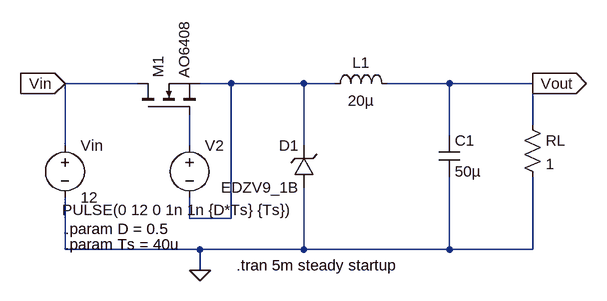
[diagram p0: schematic Draft2.asc]
Draft2.asc, the LTspice schematic file:
Version 4
SHEET 1 916 680
WIRE 16 32 -96 32
WIRE 160 32 112 32
WIRE 272 32 160 32
WIRE 320 32 272 32
WIRE 496 32 400 32
WIRE 624 32 496 32
WIRE 624 96 624 32
WIRE 496 112 496 32
WIRE -96 128 -96 32
WIRE 96 128 96 80
WIRE 272 128 272 32
WIRE 96 240 96 208
WIRE 160 240 160 32
WIRE 160 240 96 240
WIRE -96 288 -96 208
WIRE 112 288 -96 288
WIRE 272 288 272 192
WIRE 272 288 112 288
WIRE 496 288 496 176
WIRE 496 288 272 288
WIRE 624 288 624 176
WIRE 624 288 496 288
WIRE 112 320 112 288
FLAG -96 32 Vin
IOPIN -96 32 In
FLAG 624 32 Vout
IOPIN 624 32 Out
FLAG 112 320 0
SYMBOL nmos 16 80 R270
SYMATTR InstName M1
SYMATTR Value AO6408
SYMBOL ind 304 48 R270
WINDOW 0 32 56 VTop 2
WINDOW 3 5 56 VBottom 2
SYMATTR InstName L1
SYMATTR Value 20µ
SYMATTR SpiceLine Rser=20m
SYMBOL zener 288 192 R180
WINDOW 0 24 64 Left 2
WINDOW 3 24 0 Left 2
SYMATTR InstName D1
SYMATTR Value EDZV9_1B
SYMATTR Description Diode
SYMATTR Type diode
SYMBOL cap 480 112 R0
SYMATTR InstName C1
SYMATTR Value 50µ
SYMATTR SpiceLine Rser=1m
SYMBOL res 608 80 R0
SYMATTR InstName RL
SYMATTR Value 1
SYMBOL voltage -96 112 R0
WINDOW 123 0 0 Left 0
WINDOW 39 0 0 Left 0
SYMATTR InstName Vin
SYMATTR Value 12
SYMBOL voltage 96 112 R0
WINDOW 3 -196 115 Left 2
WINDOW 123 0 0 Left 0
WINDOW 39 0 0 Left 0
SYMATTR Value PULSE(0 12 0 1n 1n {D*Ts} {Ts})
SYMATTR InstName V2
TEXT -96 256 Left 2 !.param D = 0.5
TEXT -96 280 Left 2 !.param Ts = 40u
TEXT 168 312 Left 2 !.tran 5m steady startup

The netlist it stands for:
* Draft2.asc
M1 Vin N002 N001 N001 AO6408
L1 N001 Vout 20µ Rser=20m
D1 0 N001 EDZV9_1B
C1 Vout 0 50µ Rser=1m
RL Vout 0 1
Vin Vin 0 12
V2 N002 N001 PULSE(0 12 0 1n 1n {D*Ts} {Ts})
.model D D
.lib standard.dio
.model NMOS NMOS
.model PMOS PMOS
.lib standard.mos
.param D = 0.5
.param Ts = 40u
.tran 5m steady startup
.backanno
.end